# Altium schematic sheet DW1000.SchDoc
size A; SheetNumber: 2; SheetTotal: 6
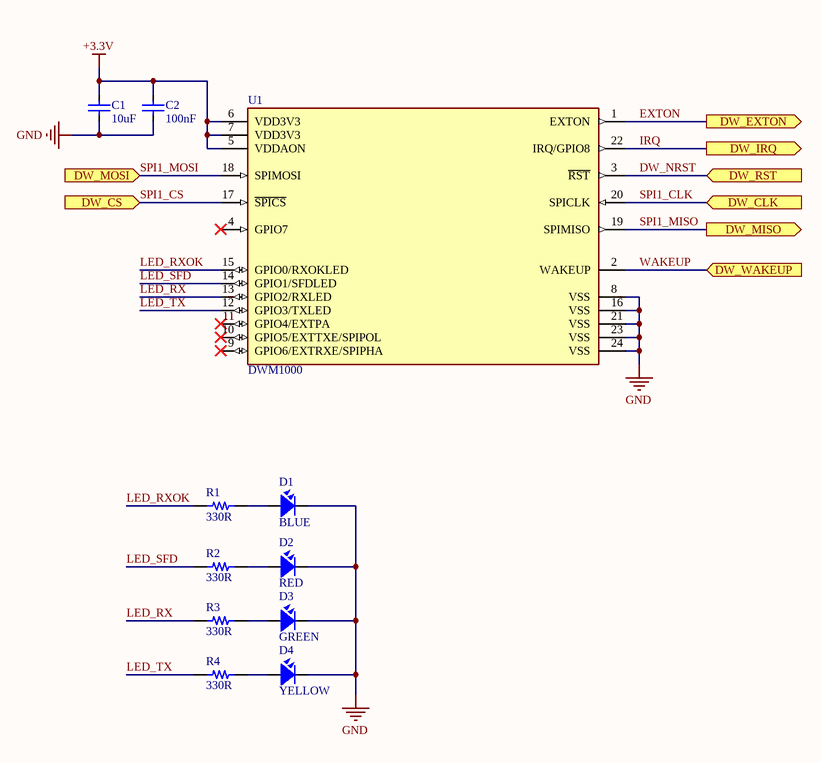
[diagram p0: DW1000.SchDoc]

## Parts
C1  10uF  [CAP_0603]
C2  100nF  [CAP_0603]
D1  BLUE  [LED-0603-Green]
D2  RED  [LED-0603-Red]
D3  GREEN  [LED-0603-Green]
D4  YELLOW  [LED-0603-Green]
R1  330R  [RES-SMD-0603]
R2  330R  [RES-SMD-0603]
R3  330R  [RES-SMD-0603]
R4  330R  [RES-SMD-0603]
U1  DWM1000  [DW1000]

## Ports
DW_CLK (in), DW_CS (in), DW_EXTON (out), DW_IRQ (out), DW_MISO (out), DW_MOSI (in), DW_RST (in), DW_WAKEUP (in)

## Nets
+3.3V: C1.2 C2.2 U1.5(VDDAON) U1.6(VDD3V3) U1.7(VDD3V3)
GND: C1.1 C2.1 D1.2 D2.2 D3.2 D4.2 U1.8(VSS) U1.16(VSS) U1.21(VSS) U1.23(VSS) U1.24(VSS)
DW_NRST: U1.3(~{RST}) ; port DW_RST
EXTON: U1.1(EXTON) ; port DW_EXTON
IRQ: U1.22(IRQ/GPIO8) ; port DW_IRQ
LED_RX: R3.2 U1.13(GPIO2/RXLED)
LED_RXOK: R1.2 U1.15(GPIO0/RXOKLED)
LED_SFD: R2.2 U1.14(GPIO1/SFDLED)
LED_TX: R4.2 U1.12(GPIO3/TXLED)
SPI1_CLK: U1.20(SPICLK) ; port DW_CLK
SPI1_CS: U1.17(~{SPICS}) ; port DW_CS
SPI1_MISO: U1.19(SPIMISO) ; port DW_MISO
SPI1_MOSI: U1.18(SPIMOSI) ; port DW_MOSI
WAKEUP: U1.2(WAKEUP) ; port DW_WAKEUP
NetD1_1: D1.1 R1.1
NetD2_1: D2.1 R2.1
NetD3_1: D3.1 R3.1
NetD4_1: D4.1 R4.1

Not connected (* = marked no-connect by the designer): U1 4(GPIO7)* 9(GPIO6/EXTRXE/SPIPHA)* 10(GPIO5/EXTTXE/SPIPOL)* 11(GPIO4/EXTPA)*

## Library data of the parts
C1 C2 = CapSMD: Capacitor; Value: 33p; Published: 8-Jun-2000; LatestRevisionDate: 17-Jul-2002; LatestRevisionNote: Re-released for DXP Platform.; PackageReference: RAD-0.3; Publisher: Altium Limited
D1-D4 = LED: LED Single colour Green and Red; Value: LED 3 ly Single Colour
R1-R4 = Resistor - SMD: Resistor; Manufacturer: Generic Components; Class: Passive; Published: 08/06/2000; Publisher: Altium Hobart Technology Centre
U1 = DWM1000: Decawave's DW1000 Ultra / Wideband (UWB) transceiver IC